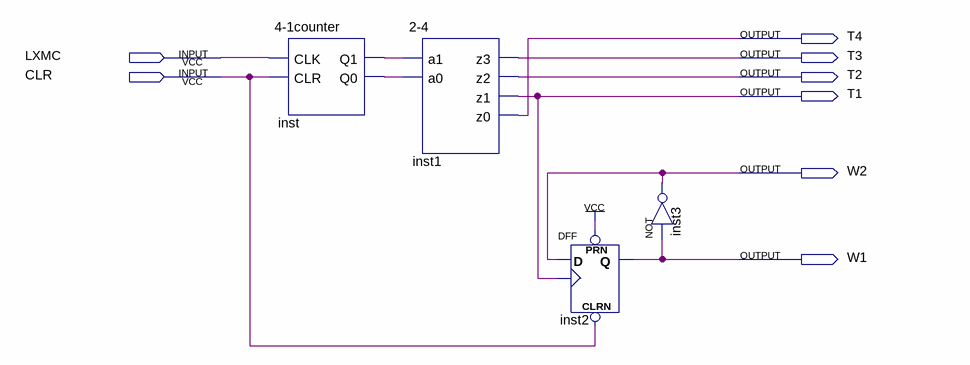
[diagram p0: schematic sheet]
// Quartus schematic beat.bdf as structural Verilog: 4 symbols, 8 pins
module beat (
  input  LXMC,
  input  CLR,
  output T4,
  output T3,
  output T2,
  output T1,
  output W2,
  output W1
);

  wire inst_q0, inst_q1;

  \4-1counter  inst (.CLK(LXMC), .CLR(CLR), .Q1(inst_q1), .Q0(inst_q0));
  \2-4  inst1 (.a1(inst_q1), .a0(inst_q0), .z3(T3), .z2(T2), .z1(T1), .z0(T4));
  DFF inst2 (.CLRN(CLR), .CLK(T1), .D(W2), .PRN(1'b1), .Q(W1));
  not inst3 (W2, W1);
endmodule
